# Altium schematic sheet CanTransceiver.SchDoc
size A4; Author: Pablo R Nava; DrawnBy: Pablo R Nava; Engineer: Pablo R Nava
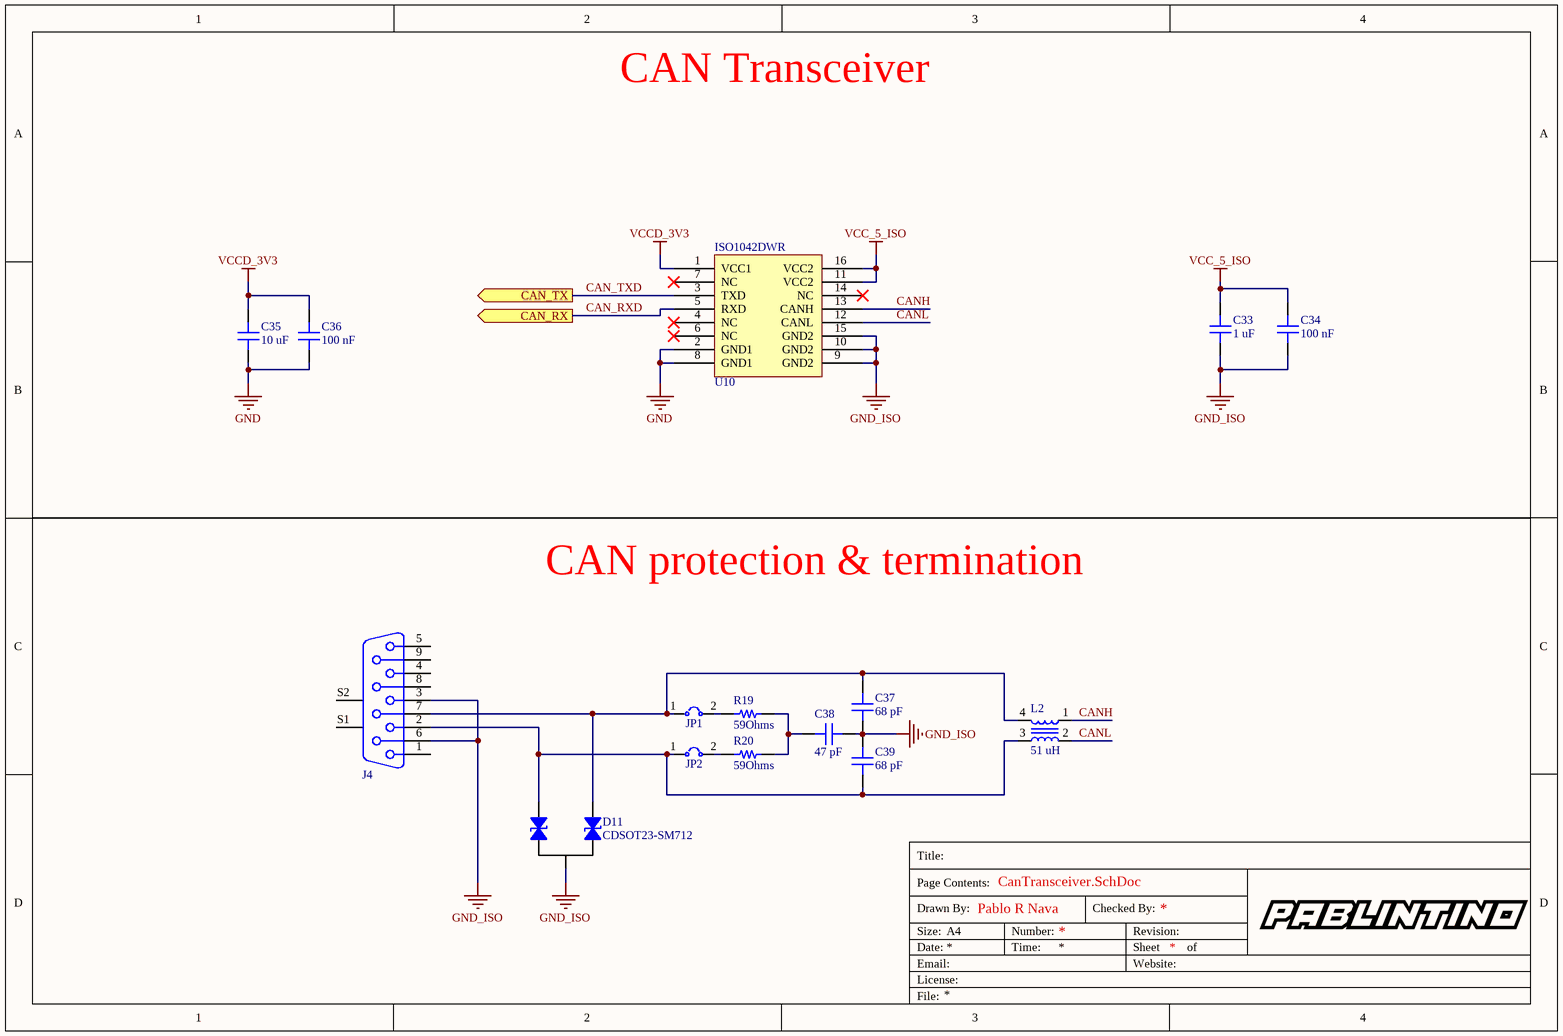
[diagram p0: CanTransceiver.SchDoc]

## Parts
C33  1 uF  [CAP 0603_1608]
C34  100 nF  [CAP 0603_1608]
C35  10 uF  [CAP 0805_2012]
C36  100 nF  [CAP 0603_1608]
C37  68 pF  [CAP 0603_1608]
C38  47 pF  [CAP 0603_1608]
C39  68 pF  [CAP 0603_1608]
D11  CDSOT23-SM712  [BOURNS SOT-23-3]
J4  09681537613  [DSUB9]  (value not drawn)
JP1  61300211121  [JUMPER-100]  (value not drawn)
JP2  61300211121  [JUMPER-100]  (value not drawn)
L2  51 uH  [TDK_ACT45B]
R19  59Ohms  [RES 1206_3216]
R20  59Ohms  [RES 1206_3216]
U10  ISO1042DWR  [TI-DW16_N]

## Ports
CAN_RX (out), CAN_TX (out)

## Nets
GND: C35.2 C36.2 U10.2(GND1) U10.8(GND1)
GND_ISO: C33.1 C34.2 C37.2 C38.1 C39.1 D11.3 J4.3 J4.6 U10.9(GND2) U10.10(GND2) U10.15(GND2)
VCC_5_ISO: C33.2 C34.1 U10.11(VCC2) U10.16(VCC2)
VCCD_3V3: C35.1 C36.1 U10.1(VCC1)
CAN_RXD: U10.5(RXD) ; port CAN_RX
CAN_TXD: U10.3(TXD) ; port CAN_TX
CANH: L2.1 U10.13(CANH)
CANL: L2.2 U10.12(CANL)
NetC37_1: C37.1 D11.2 J4.7 JP1.1(A) L2.4
NetC38_2: C38.2 R19.1 R20.1
NetC39_2: C39.2 D11.1 J4.2 JP2.1(A) L2.3
NetJP1_2: JP1.2(K) R19.2
NetJP2_2: JP2.2(K) R20.2

Not connected (* = marked no-connect by the designer): J4 1 4 5 8 9 S1 S2; U10 4(NC)* 6(NC)* 7(NC)* 14(NC)*

## Notes on the sheet
- CAN Transceiver
- CAN protection & termination
- Title:
- Drawn By:
- Page Contents:
- Checked By:
- Size:
- Date:
- File:
- License:
- Email:
- A4
- Number:
- Time:
- Revision:
- Sheet
- Website:
- of

## Library data of the parts
C33 = 06033C105KAT4A: MLCC Ceramic 1 uF 25 V 10% Capacitor; Manufacturer: AVX; Voltage: 25 V; Type: capacitor_ceramic; Through Hole: 0; Part Number: 06033C105KAT4A; Value: 1 uF; Tolerance: 10%; Composition: X7R; Created On: 22/06/2020 21:33:54; Updated On: 22/06/2020 21:34:12; Package: 0603 (1608 Metric)
C34 = 0603YC104KAT2A: MLCC Ceramic 100 nF 16 V 10% Capacitor; Manufacturer: AVX; Voltage: 16 V; Type: capacitor_ceramic; Through Hole: 0; Part Number: 0603YC104KAT2A; Value: 100 nF; Tolerance: 10%; Composition: X7R; Created On: 22/07/2020 19:09:12; Updated On: 22/07/2020 19:10:15; Package: 0603 (1608 Metric)
C35 = 0805YC106MAT2A: MLCC Ceramic 10 uF 25 V 20% Capacitor; Manufacturer: AVX; Voltage: 16 V; Type: capacitor_ceramic; Through Hole: 0; Part Number: 0805YC106MAT2A; Value: 10 uF; Tolerance: 20%; Composition: X7R; Created On: 22/06/2020 21:37:18; Updated On: 22/06/2020 21:37:31; Package: 0805 (2012 Metric)
C36 = 06035C104K4Z2A: MLCC Ceramic 100 nF 50 V 10% Capacitor; Manufacturer: AVX; Voltage: 50 V; Type: capacitor_ceramic; Through Hole: 0; Part Number: 06035C104K4Z2A; Value: 100 nF; Tolerance: 10%; Composition: X7R; Created On: 22/06/2020 21:28:51; Updated On: 22/06/2020 21:29:02; Package: 0603 (1608 Metric)
C37 C39 = 06031A680FAT2A: MLCC Ceramic 68 pF 100 V 1% Capacitor; Manufacturer: AVX; Voltage: 100 V; Type: capacitor_ceramic; Through Hole: 0; Part Number: 06031A680FAT2A; Value: 68 pF; Tolerance: 1%; Composition: NP0; Created On: 04/08/2020 0:35:07; Updated On: 04/08/2020 0:35:13; Package: 0603 (1608 Metric)
C38 = 06031U470FAT2A: MLCC Ceramic 47 pF 100 V 1% Capacitor; Manufacturer: AVX; Voltage: 100 V; Type: capacitor_ceramic; Through Hole: 0; Part Number: 06031U470FAT2A; Value: 47 pF; Tolerance: 1%; Composition: NP0; Created On: 04/08/2020 0:33:07; Updated On: 04/08/2020 0:33:40; Package: 0603 (1608 Metric)
D11 = CDSOT23-SM712: CAN bus TVS diode; Manufacturer: Bourns; Standoff Reverse Voltage: 13.3 V; Minimum Breakdown Voltage: 12 V; Maximum Clamping Voltage: 26 V; Type: diode_tvs; Through Hole: 0; Part Number: CDSOT23-SM712; Created On: 22/06/2020 21:57:13; Updated On: 22/06/2020 21:57:43; Package: SOT-23
J4 = 09681537613: DSUB SV FE SSDP ANG-US 09P AU3; Manufacturer: Harting; Pitch: 2.77 mm; Current Rating: 6 A; Number of Contacts: 9; Through Hole: 1; Part Number: 09681537613; Orientation: right; Number of Rows: 2; Created On: 18/07/2020 11:53:48; Updated On: 18/07/2020 11:54:47; Type: connector_pcb; Package: Through Hole
JP1 JP2 = 61300211121: Connector Header Through Hole 2 position 0.100 (2.54mm); Manufacturer: Würth Elektronik; Pitch: 100 mil; Voltage Rating: 250 V; Current Rating: 3 A; Number of Contacts: 2; Through Hole: 1; Part Number: 61300211121; Orientation: straight; Number of Rows: 1; Created On: 19/07/2020 13:40:52; Updated On: 19/07/2020 13:41:17; Type: connector_pcb; Package: Through Hole
L2 = ACT45B-510-2P-TL003: CAN Bus Common Choke; Manufacturer: TDK; Number of Lines: 2; DC Resistance: 1 Ohms; Impedance Frequency: 2800 Ohms @ 10 MHz; Current Rating: 200 mA; Type: inductor_choke; Through Hole: 0; Part Number: ACT45B-510-2P-TL003; Value: 51 uH; Created On: 23/06/2020 19:40:24; Updated On: 23/06/2020 20:05:36; Package: ACT45B
R19 R20 = CRCW120659R0FKEA: Thin Film Resistor 59 Ohms 1%; Manufacturer: Vishay / Dale; Power Max: 250 mW; Through Hole: 0; Part Number: CRCW120659R0FKEA; Value: 59Ohms; Tolerance: 1%; Created On: 04/08/2020 0:42:53; Updated On: 04/08/2020 0:43:02; Type: resistor; Package: 1206 (3216 Metric)
U10 = ISO1042DWR: Isolated CAN FD Transceiver; Manufacturer: Texas Instruments; Duplex: Full-Duplex; Data Rate: 5Mbps; Supply Voltage: 5 V; Through Hole: 0; Part Number: ISO1042DWR; Protocol: CAN; Created On: 22/06/2020 19:10:03; Updated On: 22/06/2020 19:54:36; Type: transceiver; Package: SOIC-16